# EAGLE schematic P0.1 (EAGLE 6.5.0)
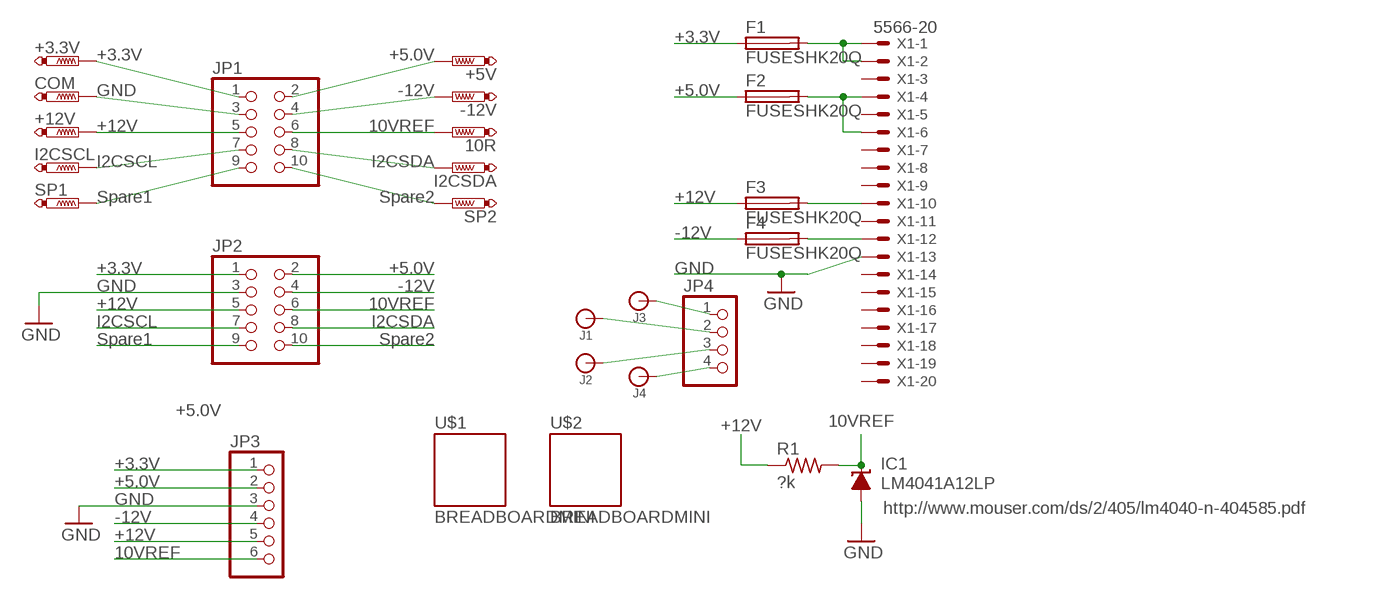
[diagram p0: schematic, sheet 1]

## Parts
10R  PTR1B1,27  [B1,27]
+3.3V  PTR1B1,27  [B1,27]
+5V  PTR1B1,27  [B1,27]
+12V  PTR1B1,27  [B1,27]
-12V  PTR1B1,27  [B1,27]
COM  PTR1B1,27  [B1,27]
F1  FUSESHK20Q  [SHK20Q]
F2  FUSESHK20Q  [SHK20Q]
F3  FUSESHK20Q  [SHK20Q]
F4  FUSESHK20Q  [SHK20Q]
I2CSCL  PTR1B1,27  [B1,27]
I2CSDA  PTR1B1,27  [B1,27]
IC1  LM4041A12LP  [LP_O-PBCY-W3]
J1  BANANA_CONN  [BANANA_CONN]
J2  BANANA_CONN  [BANANA_CONN]
J3  BANANA_CONN  [BANANA_CONN]
J4  BANANA_CONN  [BANANA_CONN]
JP1  PINHD-2X5/90  [2X05/90]
JP2  PINHD-2X5/90  [2X05/90]
JP3  PINHD-1X6  [1X06]
JP4  PINHD-1X4  [1X04]
R1  ?k  R-US_0204/7  [0204/7]
SP1  PTR1B1,27  [B1,27]
SP2  PTR1B1,27  [B1,27]
U$1  BREADBOARDMINI  [BREADBOARD-MINI]
U$2  BREADBOARDMINI  [BREADBOARD-MINI]
X1  5566-20  [5566-20]

## Nets
10VREF: 10R.TP IC1.2(C) JP1.6 JP2.6 JP3.6 R1.2
+3.3V: +3.3V.TP F1.1A JP1.1 JP2.1 JP3.1
+5.0V: +5V.TP F2.1A JP1.2 JP2.2 JP3.2
+12V: +12V.TP F3.1A JP1.5 JP2.5 JP3.5 R1.1
-12V: -12V.TP F4.1A JP1.4 JP2.4 JP3.4
GND: COM.TP IC1.3(A) JP1.3 JP2.3 JP3.3 X1.13
I2CSCL: I2CSCL.TP JP1.7 JP2.7
I2CSDA: I2CSDA.TP JP1.8 JP2.8
N$1: F2.2A X1.4 X1.6
N$2: F3.2A X1.10
N$3: F4.2A X1.12
N$4: J3.P$1 JP4.1
N$5: F1.2A X1.1 X1.2
N$6: J1.P$1 JP4.2
N$7: J2.P$1 JP4.3
N$8: J4.P$1 JP4.4
SPARE1: JP1.9 JP2.9 SP1.TP
SPARE2: JP1.10 JP2.10 SP2.TP
Unconnected: X1.3 X1.5 X1.7 X1.8 X1.9 X1.11 X1.14 X1.15 X1.16 X1.17 X1.18 X1.19 X1.20

## Notes on the sheet
- +3.3V
- +3.3V | +5.0V
- GND | -12V | +5.0V
- +12V | 10VREF
- I2CSCL | I2CSDA
- Spare1 | Spare2 | +12V
- -12V
- +3.3V | +5.0V | GND
- GND | -12V
- +12V | 10VREF
- I2CSCL | I2CSDA
- Spare1 | Spare2
- +5.0V | 10VREF
- +12V
- +3.3V
- +5.0V
- GND
- http://www.mouser.com/ds/2/405/lm4040-n-404585.pdf
- -12V
- +12V
- 10VREF

## Library data of the parts
10R +3.3V +5V +12V -12V COM I2CSCL I2CSDA SP1 SP2 = testpad:PTR1: TEST PIN
F1-F4 = fuse:FUSE: Fuse; OC_FARNELL: unknown; OC_NEWARK: unknown
IC1 = texas:LM4041: PRECISION MICROPOWER SHUNT VOLTAGE REFERENCE Source: http://focus.ti.com/lit/ds/slcs146e/slcs146e.pdf; OC_FARNELL: 9486119; OC_NEWARK: unknown
J1-J4 = SparkFun-Connectors:BANANA_CONN: Through-hole banana jack
JP1 JP2 = pinhead+:PINHD-2X5: PIN HEADER
JP3 = pinhead+:PINHD-1X6: PIN HEADER
JP4 = pinhead+:PINHD-1X4: PIN HEADER
R1 = rcl:R-US_: RESISTOR, American symbol
U$1 U$2 = SparkFun-Boards:BREADBOARD: Breadboard Mini Self Adhesive This is the mechnical outline for the very small self adhesive breadboard from SparkFun Electronics. Good for very small proto areas. SKU : PRT-07916; PROD_ID: COMP-12034
X1 = con-molex:5566-20: Mini FIT connector 20 pol ATX PC-Motherboard Power connector Source: http://www.molex.com; OC_FARNELL: unknown; OC_NEWARK: unknown